# EAGLE design Nixie_v1 (EAGLE 8.7.0)
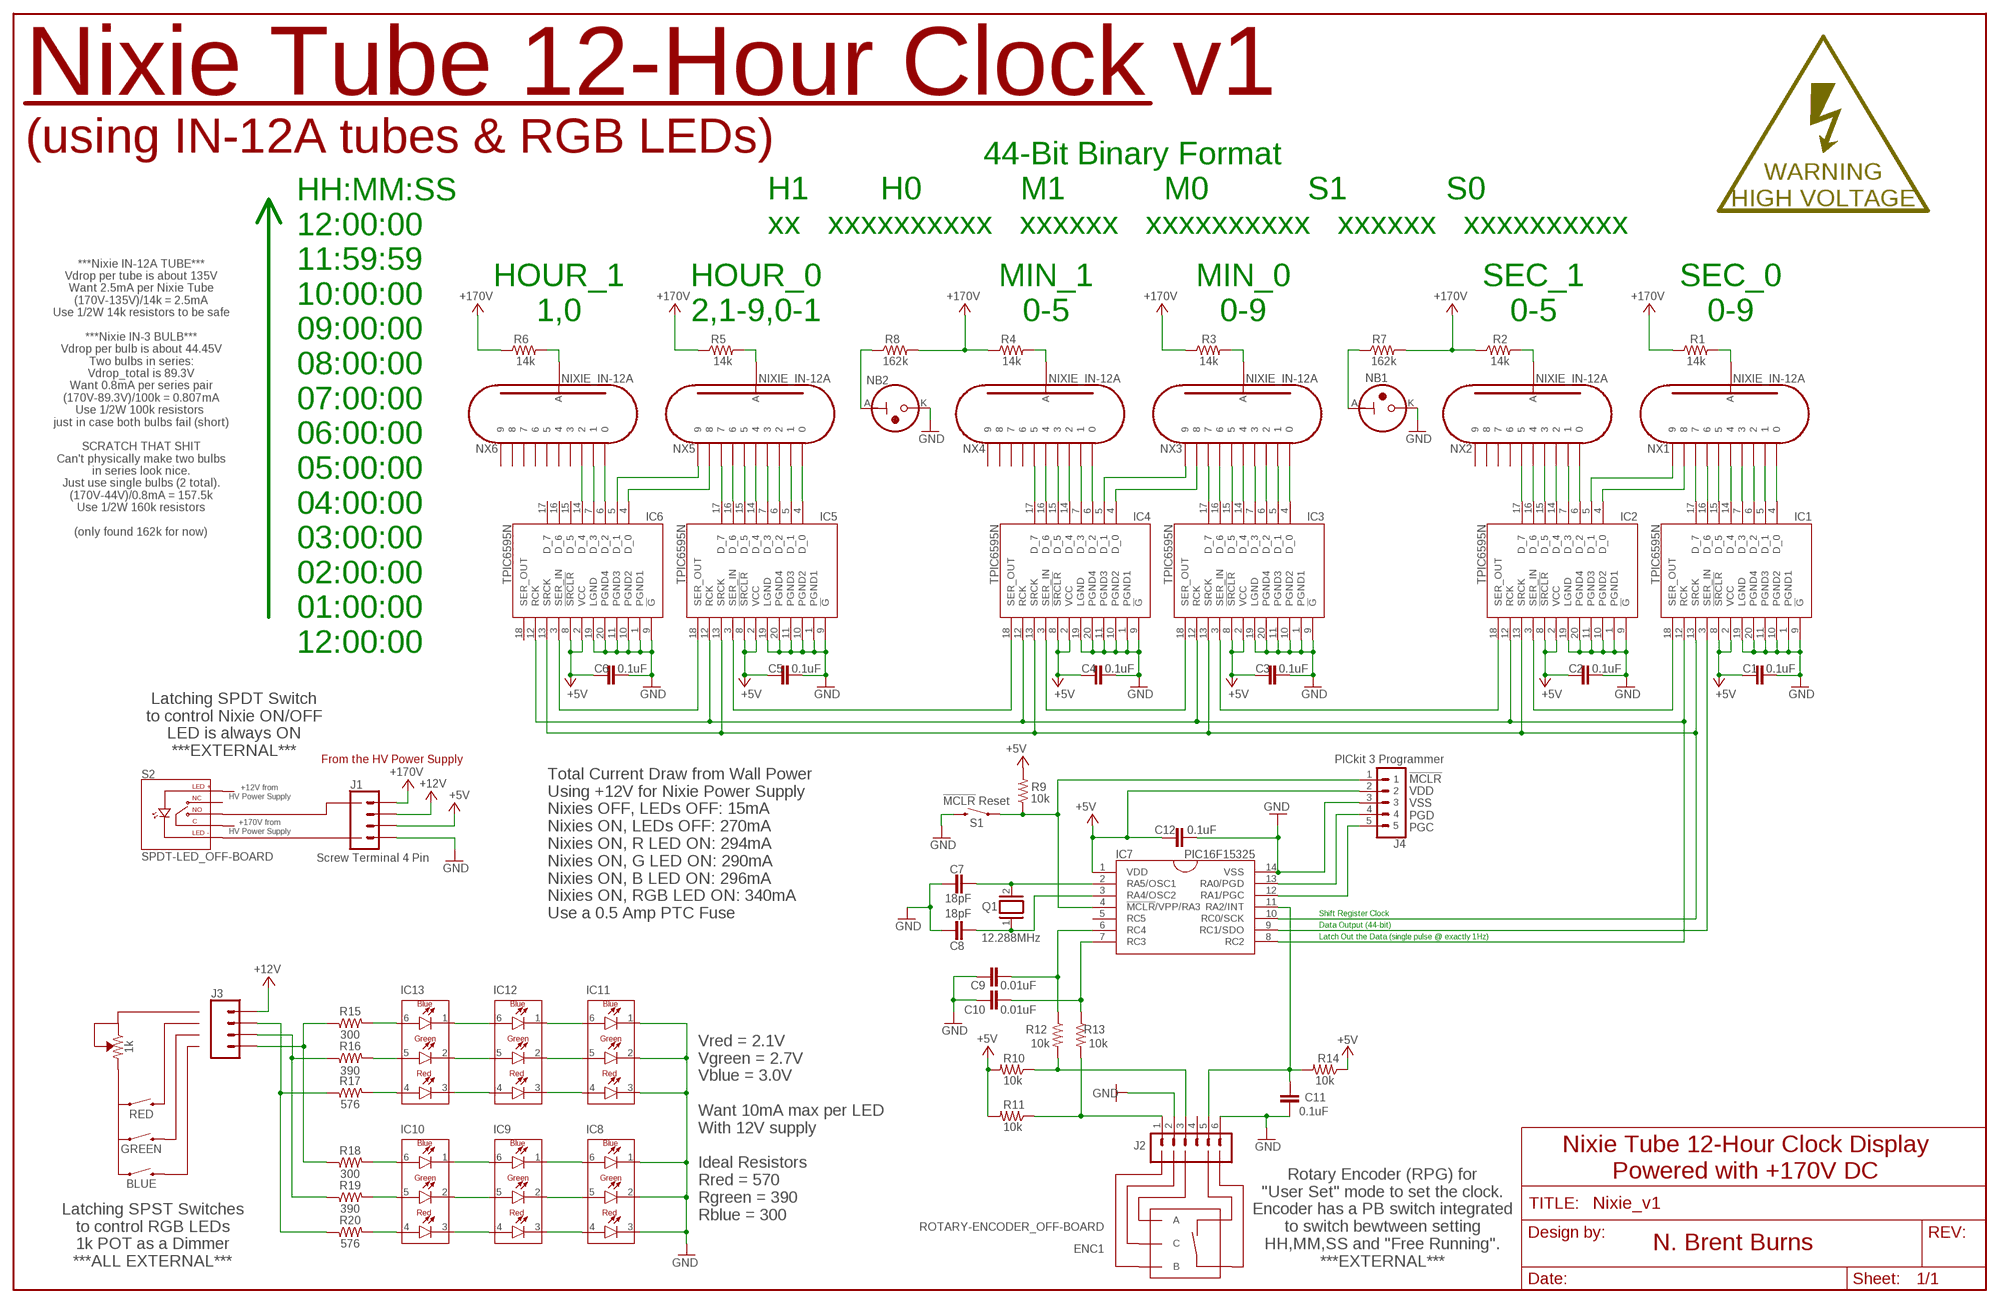
[diagram p0: schematic, sheet 1]

## Parts
C1  0.1uF  C2.5/2  [C2.5-2]
C2  0.1uF  C2.5/2  [C2.5-2]
C3  0.1uF  C2.5/2  [C2.5-2]
C4  0.1uF  C2.5/2  [C2.5-2]
C5  0.1uF  C2.5/2  [C2.5-2]
C6  0.1uF  C2.5/2  [C2.5-2]
C7  18pF  C2.5/2  [C2.5-2]
C8  18pF  C2.5/2  [C2.5-2]
C9  0.01uF  C2.5/2  [C2.5-2]
C10  0.01uF  C2.5/2  [C2.5-2]
C11  0.1uF  C2.5/2  [C2.5-2]
C12  0.1uF  C2.5/2  [C2.5-2]
ENC1  ROTARY-ENCODER_OFF-BOARD  (no package)
IC1  TPIC6595N  SHIFT_REG_TPIC6595N  [DIP20]
IC2  TPIC6595N  SHIFT_REG_TPIC6595N  [DIP20]
IC3  TPIC6595N  SHIFT_REG_TPIC6595N  [DIP20]
IC4  TPIC6595N  SHIFT_REG_TPIC6595N  [DIP20]
IC5  TPIC6595N  SHIFT_REG_TPIC6595N  [DIP20]
IC6  TPIC6595N  SHIFT_REG_TPIC6595N  [DIP20]
IC7  PIC16F15325  [DIP14]
IC8  LED-RGB_CLY6D-FKC-CK1N1D1BB7D3D3  [PLCC6-LED-RGB]
IC9  LED-RGB_CLY6D-FKC-CK1N1D1BB7D3D3  [PLCC6-LED-RGB]
IC10  LED-RGB_CLY6D-FKC-CK1N1D1BB7D3D3  [PLCC6-LED-RGB]
IC11  LED-RGB_CLY6D-FKC-CK1N1D1BB7D3D3  [PLCC6-LED-RGB]
IC12  LED-RGB_CLY6D-FKC-CK1N1D1BB7D3D3  [PLCC6-LED-RGB]
IC13  LED-RGB_CLY6D-FKC-CK1N1D1BB7D3D3  [PLCC6-LED-RGB]
J1  Screw Terminal 4 Pin  CONNECTOR_4PIN  [SCREW_TERM_5MM_1X4]
J2  CONNECTOR_6PINSCREW_TERMINAL_5MM_PITCH  [SCREW_TERM_5MM_1X6]
J3  RGB Switches and 5k POT Connections  CONNECTOR_4PIN  [SCREW_TERM_5MM_1X4]
J4  PICkit 3 Programmer  CONNECTOR_5PIN  [HEADER_2.54MM_1X5]
NB1  IN-3  [IN-3]
NB2  IN-3  [IN-3]
NX1  NIXIE_IN-12A  NIXIE_IN-12ANO_HOLE  [IN-12_NO_HOLE]
NX2  NIXIE_IN-12A  NIXIE_IN-12ANO_HOLE  [IN-12_NO_HOLE]
NX3  NIXIE_IN-12A  NIXIE_IN-12ANO_HOLE  [IN-12_NO_HOLE]
NX4  NIXIE_IN-12A  NIXIE_IN-12ANO_HOLE  [IN-12_NO_HOLE]
NX5  NIXIE_IN-12A  NIXIE_IN-12ANO_HOLE  [IN-12_NO_HOLE]
NX6  NIXIE_IN-12A  NIXIE_IN-12ANO_HOLE  [IN-12_NO_HOLE]
POT1  1k  POT_OFF-BOARD  (no package)
Q1  12.288MHz  XTAL/S  [QS]
R1  14k  R-US_0411/12  [0411/12]
R2  14k  R-US_0411/12  [0411/12]
R3  14k  R-US_0411/12  [0411/12]
R4  14k  R-US_0411/12  [0411/12]
R5  14k  R-US_0411/12  [0411/12]
R6  14k  R-US_0411/12  [0411/12]
R7  162k  R-US_0411/12  [0411/12]
R8  162k  R-US_0411/12  [0411/12]
R9  10k  R-US_0207/7  [0207/7]
R10  10k  R-US_0207/7  [0207/7]
R11  10k  R-US_0207/7  [0207/7]
R12  10k  R-US_0207/7  [0207/7]
R13  10k  R-US_0207/7  [0207/7]
R14  10k  R-US_0207/7  [0207/7]
R15  300  R-US_0207/7  [0207/7]
R16  390  R-US_0207/7  [0207/7]
R17  576  R-US_0207/7  [0207/7]
R18  300  R-US_0207/7  [0207/7]
R19  390  R-US_0207/7  [0207/7]
R20  576  R-US_0207/7  [0207/7]
S1  !MCLR! Reset  MOMENTARY-SWITCH-SPST-PTH-6.0MM  [TACTILE_SWITCH_PTH_6.0MM]
S2  SPDT-LED_OFF-BOARD  (no package)
S3  BLUE  SPST_OFF-BOARD  (no package)
S4  GREEN  SPST_OFF-BOARD  (no package)
S5  RED  SPST_OFF-BOARD  (no package)
SYM101  SYMBOL_HIGH_VOLTAGE  [SYMBOL_HIGH_VOLTAGE]

## Nets
+5V [POWER]: C1.2 C2.2 C3.2 C4.2 C5.2 C6.2 C12.1 IC1.2(VCC) IC1.8(!SRCLR) IC2.2(VCC) IC2.8(!SRCLR) IC3.2(VCC) IC3.8(!SRCLR) IC4.2(VCC) IC4.8(!SRCLR) IC5.2(VCC) IC5.8(!SRCLR) IC6.2(VCC) IC6.8(!SRCLR) IC7.1(VDD) J1.2 J4.2 R9.2 R10.2 R11.2 R14.1
+12V [POWER]: J1.3 J3.4
+170V [POWER]: J1.4 R1.1 R2.1 R3.1 R4.1 R5.1 R6.1 R7.2 R8.2
GND [GND]: C1.1 C2.1 C3.1 C4.1 C5.1 C6.1 C7.2 C8.2 C9.2 C10.2 C11.1 C12.2 IC1.1(PGND1) IC1.9(!G) IC1.10(PGND2) IC1.11(PGND3) IC1.19(LGND) IC1.20(PGND4) IC2.1(PGND1) IC2.9(!G) IC2.10(PGND2) IC2.11(PGND3) IC2.19(LGND) IC2.20(PGND4) IC3.1(PGND1) IC3.9(!G) IC3.10(PGND2) IC3.11(PGND3) IC3.19(LGND) IC3.20(PGND4) IC4.1(PGND1) IC4.9(!G) IC4.10(PGND2) IC4.11(PGND3) IC4.19(LGND) IC4.20(PGND4) IC5.1(PGND1) IC5.9(!G) IC5.10(PGND2) IC5.11(PGND3) IC5.19(LGND) IC5.20(PGND4) IC6.1(PGND1) IC6.9(!G) IC6.10(PGND2) IC6.11(PGND3) IC6.19(LGND) IC6.20(PGND4) IC7.14(VSS) IC8.1(BLUE_CATHODE) IC8.2(GREEN_CATHODE) IC8.3(RED_CATHODE) IC11.1(BLUE_CATHODE) IC11.2(GREEN_CATHODE) IC11.3(RED_CATHODE) J1.1 J2.2 J2.6 J4.3 NB1.K NB2.K S1.3
N$2: IC1.4(D_0) NX1.0
N$3: IC1.5(D_1) NX1.1
N$4: IC1.6(D_2) NX1.2
N$5: IC1.7(D_3) NX1.3
N$6: IC1.14(D_4) NX1.4
N$7: IC1.15(D_5) NX1.5
N$8: IC1.16(D_6) NX1.6
N$9: IC1.17(D_7) NX1.7
N$10: NX1.A R1.2
N$11: NB2.A R8.1
N$12: NX2.A R2.2
N$13: NB1.A R7.1
N$14: NX3.A R3.2
N$15: NX4.A R4.2
N$16: NX5.A R5.2
N$17: NX6.A R6.2
N$18: IC5.4(D_0) NX5.0
N$19: IC5.5(D_1) NX5.1
N$20: IC2.4(D_0) NX1.8
N$21: IC2.5(D_1) NX1.9
N$22: IC7.12(RA1/PGC) J4.5
N$23: IC2.6(D_2) NX2.0
N$24: IC2.7(D_3) NX2.1
N$25: IC2.15(D_5) NX2.3
N$26: IC2.16(D_6) NX2.4
N$27: IC2.17(D_7) NX2.5
N$28: IC3.4(D_0) NX3.0
N$29: IC3.5(D_1) NX3.1
N$30: IC3.6(D_2) NX3.2
N$31: IC3.7(D_3) NX3.3
N$32: IC3.14(D_4) NX3.4
N$33: IC3.15(D_5) NX3.5
N$34: IC3.16(D_6) NX3.6
N$35: IC3.17(D_7) NX3.7
N$36: IC4.4(D_0) NX3.8
N$37: IC4.5(D_1) NX3.9
N$38: C7.1 IC7.2(RA5/OSC1) Q1.2
N$39: C8.1 IC7.3(RA4/OSC2) Q1.1
N$40: IC7.13(RA0/PGD) J4.4
N$41: IC4.15(D_5) NX4.3
N$42: IC4.16(D_6) NX4.4
N$43: IC4.17(D_7) NX4.5
N$44: IC5.6(D_2) NX5.2
N$45: IC5.7(D_3) NX5.3
N$46: IC5.14(D_4) NX5.4
N$47: IC5.15(D_5) NX5.5
N$48: IC5.16(D_6) NX5.6
N$49: IC5.17(D_7) NX5.7
N$50: IC6.4(D_0) NX5.8
N$51: IC6.5(D_1) NX5.9
N$52: IC6.6(D_2) NX6.0
N$53: IC6.7(D_3) NX6.1
N$54: IC5.18(SER_OUT) IC6.3(SER_IN)
N$55: IC4.18(SER_OUT) IC5.3(SER_IN)
N$56: IC3.18(SER_OUT) IC4.3(SER_IN)
N$57: IC2.18(SER_OUT) IC3.3(SER_IN)
N$58: IC1.18(SER_OUT) IC2.3(SER_IN)
N$59: IC1.12(RCK) IC2.12(RCK) IC3.12(RCK) IC4.12(RCK) IC5.12(RCK) IC6.12(RCK) IC7.8(RC2)
N$60: IC2.14(D_4) NX2.2
N$61: IC1.13(SRCK) IC2.13(SRCK) IC3.13(SRCK) IC4.13(SRCK) IC5.13(SRCK) IC6.13(SRCK) IC7.10(RC0/SCK)
N$62: IC1.3(SER_IN) IC7.9(RC1/SDO)
N$63: IC4.14(D_4) NX4.2
N$64: IC4.7(D_3) NX4.1
N$65: IC4.6(D_2) NX4.0
N$66: IC7.4(!MCLR!/VPP/RA3) J4.1 R9.1 S1.1
N$67: IC6.14(D_4) NX6.2
N$68: C11.2 IC7.11(RA2/INT) J2.5 R14.2
N$70: C10.1 IC7.7(RC3) R13.1
N$72: IC12.6(BLUE_ANODE) IC13.1(BLUE_CATHODE)
N$73: IC11.6(BLUE_ANODE) IC12.1(BLUE_CATHODE)
N$74: IC8.6(BLUE_ANODE) IC9.1(BLUE_CATHODE)
N$75: IC9.6(BLUE_ANODE) IC10.1(BLUE_CATHODE)
N$76: IC12.5(GREEN_ANODE) IC13.2(GREEN_CATHODE)
N$77: IC11.5(GREEN_ANODE) IC12.2(GREEN_CATHODE)
N$78: IC11.4(RED_ANODE) IC12.3(RED_CATHODE)
N$79: IC12.4(RED_ANODE) IC13.3(RED_CATHODE)
N$80: IC9.5(GREEN_ANODE) IC10.2(GREEN_CATHODE)
N$81: IC8.5(GREEN_ANODE) IC9.2(GREEN_CATHODE)
N$82: IC8.4(RED_ANODE) IC9.3(RED_CATHODE)
N$83: IC9.4(RED_ANODE) IC10.3(RED_CATHODE)
N$84: J2.3 R10.1 R12.2
N$85: J2.1 R11.1 R13.2
N$86: C9.1 IC7.6(RC4) R12.1
N$88: J3.1 R15.1 R18.1
N$89: J3.2 R16.1 R19.1
N$90: J3.3 R17.1 R20.1
N$94: IC13.6(BLUE_ANODE) R15.2
N$95: IC13.5(GREEN_ANODE) R16.2
N$96: IC13.4(RED_ANODE) R17.2
N$97: IC10.6(BLUE_ANODE) R18.2
N$98: IC10.5(GREEN_ANODE) R19.2
N$99: IC10.4(RED_ANODE) R20.2
Unconnected: ENC1.A ENC1.B ENC1.C ENC1.SW+ ENC1.SW- IC6.15(D_5) IC6.16(D_6) IC6.17(D_7) IC6.18(SER_OUT) IC7.5(RC5) J2.4 NX2.6 NX2.7 NX2.8 NX2.9 NX4.6 NX4.7 NX4.8 NX4.9 NX6.3 NX6.4 NX6.5 NX6.6 NX6.7 NX6.8 NX6.9 POT1.CCW POT1.CW POT1.WIPER S2.C S2.LED+ S2.LED- S2.NC S2.NO S3.1 S3.2 S4.1 S4.2 S5.1 S5.2

## Notes on the sheet
- Nixie Tube 12-Hour Clock v1
- (using IN-12A tubes & RGB LEDs)
- 44-Bit Binary Format
  H1        H0           M1           M0           S1           S0
  xx   xxxxxxxxxx   xxxxxx   xxxxxxxxxx   xxxxxx   xxxxxxxxxx
- HOUR_1
  1,0
- HOUR_0
  2,1-9,0-1
- MIN_1
  0-5
- MIN_0
  0-9
- SEC_1
  0-5
- SEC_0
  0-9
- ***Nixie IN-12A TUBE***
  Vdrop per tube is about 135V
  Want 2.5mA per Nixie Tube
  (170V-135V)/14k = 2.5mA
  Use 1/2W 14k resistors to be safe
  
  ***Nixie IN-3 BULB***
  Vdrop per bulb is about 44.45V
  Two bulbs in series:
  Vdrop_total is 89.3V
  Want 0.8mA per series pair
  (170V-89.3V)/100k = 0.807mA
  Use 1/2W 100k resistors 
  just in case both bulbs fail (short)
  
  SCRATCH THAT SHIT
  Can't physically make two bulbs
  in series look nice.
  Just use single bulbs (2 total).
  (170V-44V)/0.8mA = 157.5k
  Use 1/2W 160k resistors
  
  (only found 162k for now)
- HH:MM:SS
  12:00:00
  11:59:59
  10:00:00
  09:00:00
  08:00:00
  07:00:00
  06:00:00
  05:00:00
  04:00:00
  03:00:00
  02:00:00
  01:00:00
  12:00:00
- Latching SPDT Switch
  to control Nixie ON/OFF
  LED is always ON
  ***EXTERNAL***
- From the HV Power Supply
- +12V from
  HV Power Supply
- !MCLR
  VDD
  VSS
  PGD
  PGC
- +170V from
  HV Power Supply
- Shift Register Clock
- Total Current Draw from Wall Power
  Using +12V for Nixie Power Supply
  Nixies OFF, LEDs OFF: 15mA
  Nixies ON, LEDs OFF: 270mA
  Nixies ON, R LED ON: 294mA
  Nixies ON, G LED ON: 290mA
  Nixies ON, B LED ON: 296mA
  Nixies ON, RGB LED ON: 340mA
  Use a 0.5 Amp PTC Fuse
- Data Output (44-bit)
- Latch Out the Data (single pulse @ exactly 1Hz)
- Nixie Tube 12-Hour Clock Display
  Powered with +170V DC
- Vred = 2.1V
  Vgreen = 2.7V
  Vblue = 3.0V
  
  Want 10mA max per LED
  With 12V supply
  
  Ideal Resistors
  Rred = 570
  Rgreen = 390
  Rblue = 300
- N. Brent Burns
- Latching SPST Switches
  to control RGB LEDs
  1k POT as a Dimmer
  ***ALL EXTERNAL***
- Rotary Encoder (RPG) for
  "User Set" mode to set the clock.
  Encoder has a PB switch integrated
  to switch bewtween setting
  HH,MM,SS and "Free Running".
  ***EXTERNAL***

## Library data of the parts
C1-C12 = capacitor-wima:C: CAPACITOR naming: grid - package width
ENC1 = Brent2:ROTARY-ENCODER_OFF-BOARD
IC1-IC6 = Brent:SHIFT_REG_TPIC6595N
IC7 = Brent:PIC16F15325
IC8-IC13 = Brent:LED-RGB_CLY6D-FKC-CK1N1D1BB7D3D3
J1 J3 = Brent:CONNECTOR_4PIN
J2 = Brent:CONNECTOR_6PIN
J4 = Brent:CONNECTOR_5PIN
NB1 NB2 = russian-nixies:IN-3: IN-3: nixie bulb
NX1-NX6 = Brent:NIXIE_IN-12A
POT1 = Brent2:POT_OFF-BOARD
Q1 = special:XTAL/S: CRYSTAL
R1-R20 = rcl:R-US_: RESISTOR, American symbol; SPICEPREFIX: R
S1 = SparkFun-Switches:MOMENTARY-SWITCH-SPST: Momentary Switch (Pushbutton) - SPST Normally-open (NO) SPST momentary switches (buttons, pushbuttons). Variants PTH-12MM - 12mm square, through-hole Momentary Pushbutton Switch - 12mm Square <https://www.sparkfun.com/products/9190> (COM-09190) PTH-6.0MM, PTH-6.0MM-KIT - 6.0mm square, through-hole Mini Pushbutton Switch <https://www.sparkfun.com/products/97> (COM-00097) KIT package intended for soldering kit's - only one side of pads' copper is exposed. PTH-RIGHT-ANGLE-KIT - Right-angle, through-hole Right Angle Tactile Button <https://www.sparkfun.com/products/10791> - Used on SparkFun BigTime Watch Kit <https://www.sparkfun.com/products/11734> SMD-12MM - 12mm square, surface-mount Tactile Button - SMD (12mm) <https://www.sparkfun.com/products/12993> (COM-12993) Used on SparkFun PicoBoard <https://www.sparkfun.com/products/11888> SMD-4.5MM - 4.5mm Square Trackball Switch Used on SparkFun Blackberry Trackballer Breakout <https://www.sparkfun.com/products/13169> SMD-4.6MMX2.8MM - 4.60mm x 2.80mm, surface mount Used on SparkFun SAMD21 Mini Breakout <https://www.sparkfun.com/products/13664> SMD-5.2MM, SMD-5.2-REDUNDANT - 5.2mm square, surface-mount Mini Pushbutton Switch - SMD <https://www.sparkfun.com/products/8720> (COM-08720) Used on Arduino Pro Mini <https://www.sparkfun.com/products/11114> REDUNDANT package connects both switch circuits together SMD-6.0X3.5MM - 6.0 x 3.5mm, surface mount Momentary Reset Switch SMD <https://www.sparkfun.com/products/8229> (COM-08229) SMD-6.2MM-TALL - 6.2mm square, surface mount Tactile Button - SMD (6mm) <https://www.sparkfun.com/products/12992> Used on SparkFun Digital Sandbox <https://www.sparkfun.com/products/12651> SMD-RIGHT-ANGLE - Right-angle, surface mount Used on SparkFun Block for Intel® Edison - Arduino <https://www.sparkfun.com/products/13036>; PROD_ID: SWCH-08441; SF_SKU: COM-00097
S2 = Brent2:SPDT-LED_OFF-BOARD
S3-S5 = Brent2:SPST_OFF-BOARD
SYM101 = Brent:SYMBOL_HIGH_VOLTAGE

## Net classes
0 default: width 0.254 mm, clearance 0.205 mm
1 GND: width 0.762 mm, clearance 0.205 mm to class 0, clearance 0.205 mm
2 POWER: width 0.762 mm, clearance 0.205 mm to class 0, clearance 0.205 mm to class 1, clearance 0.205 mm

## Board
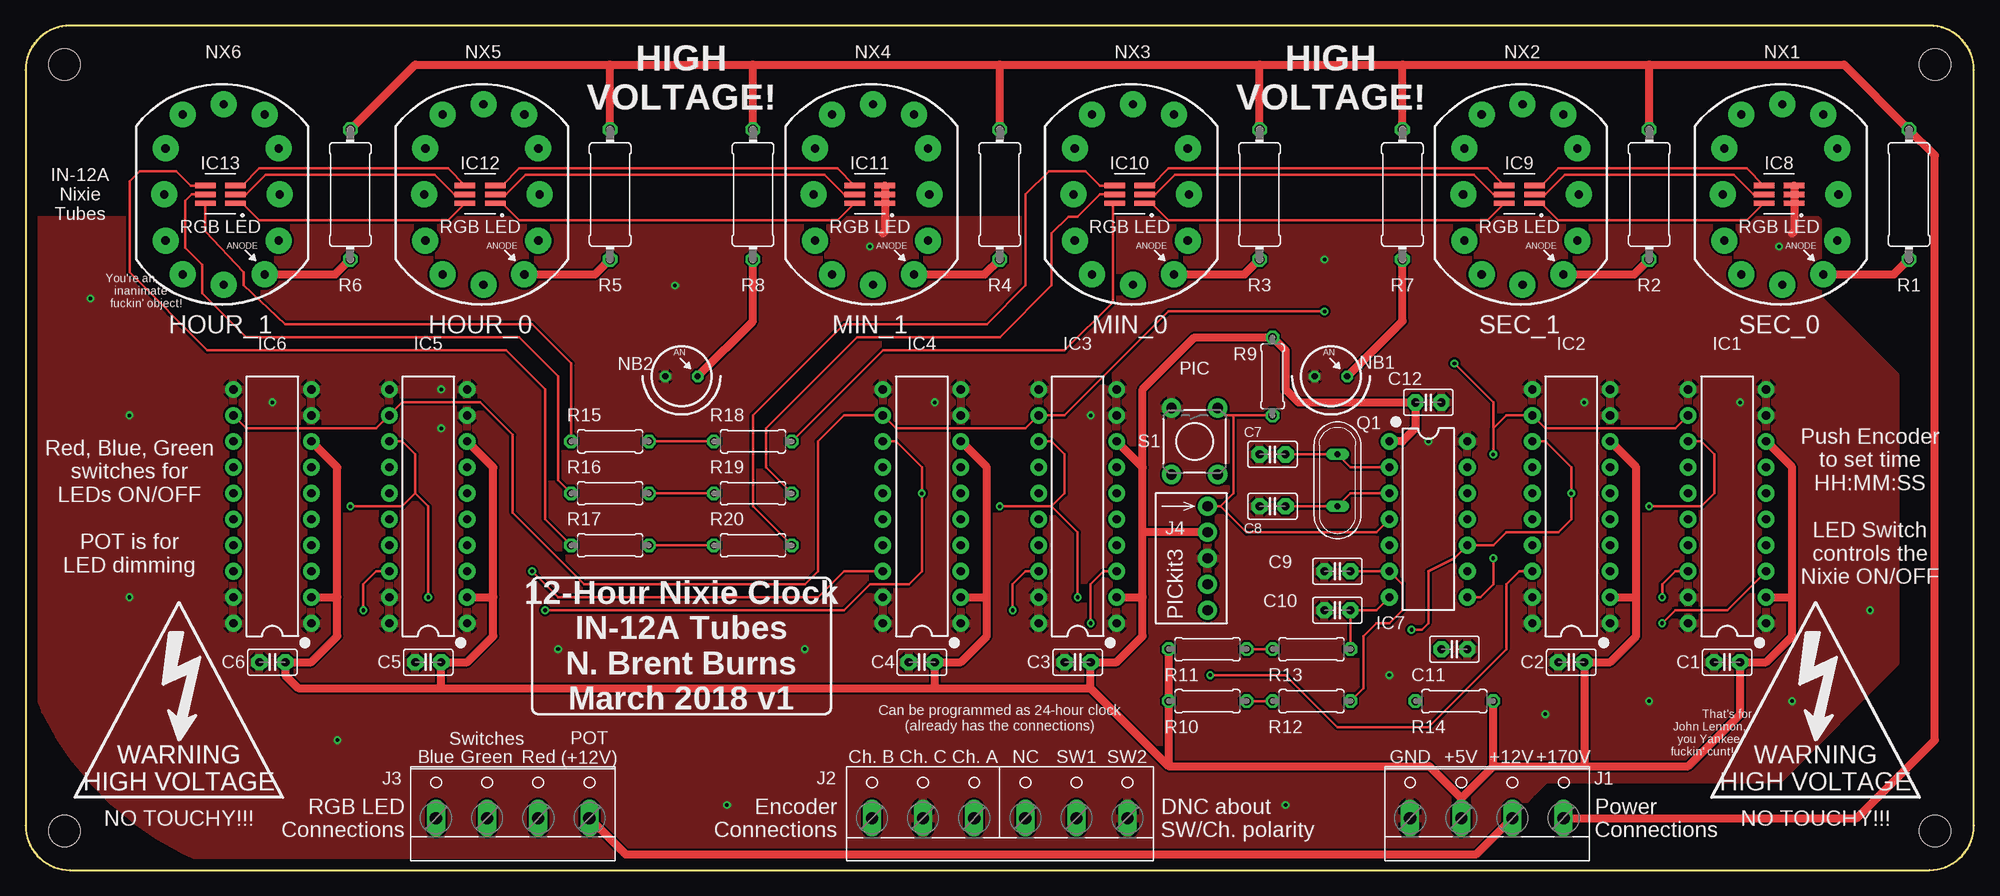
[diagram p1: board, top side]
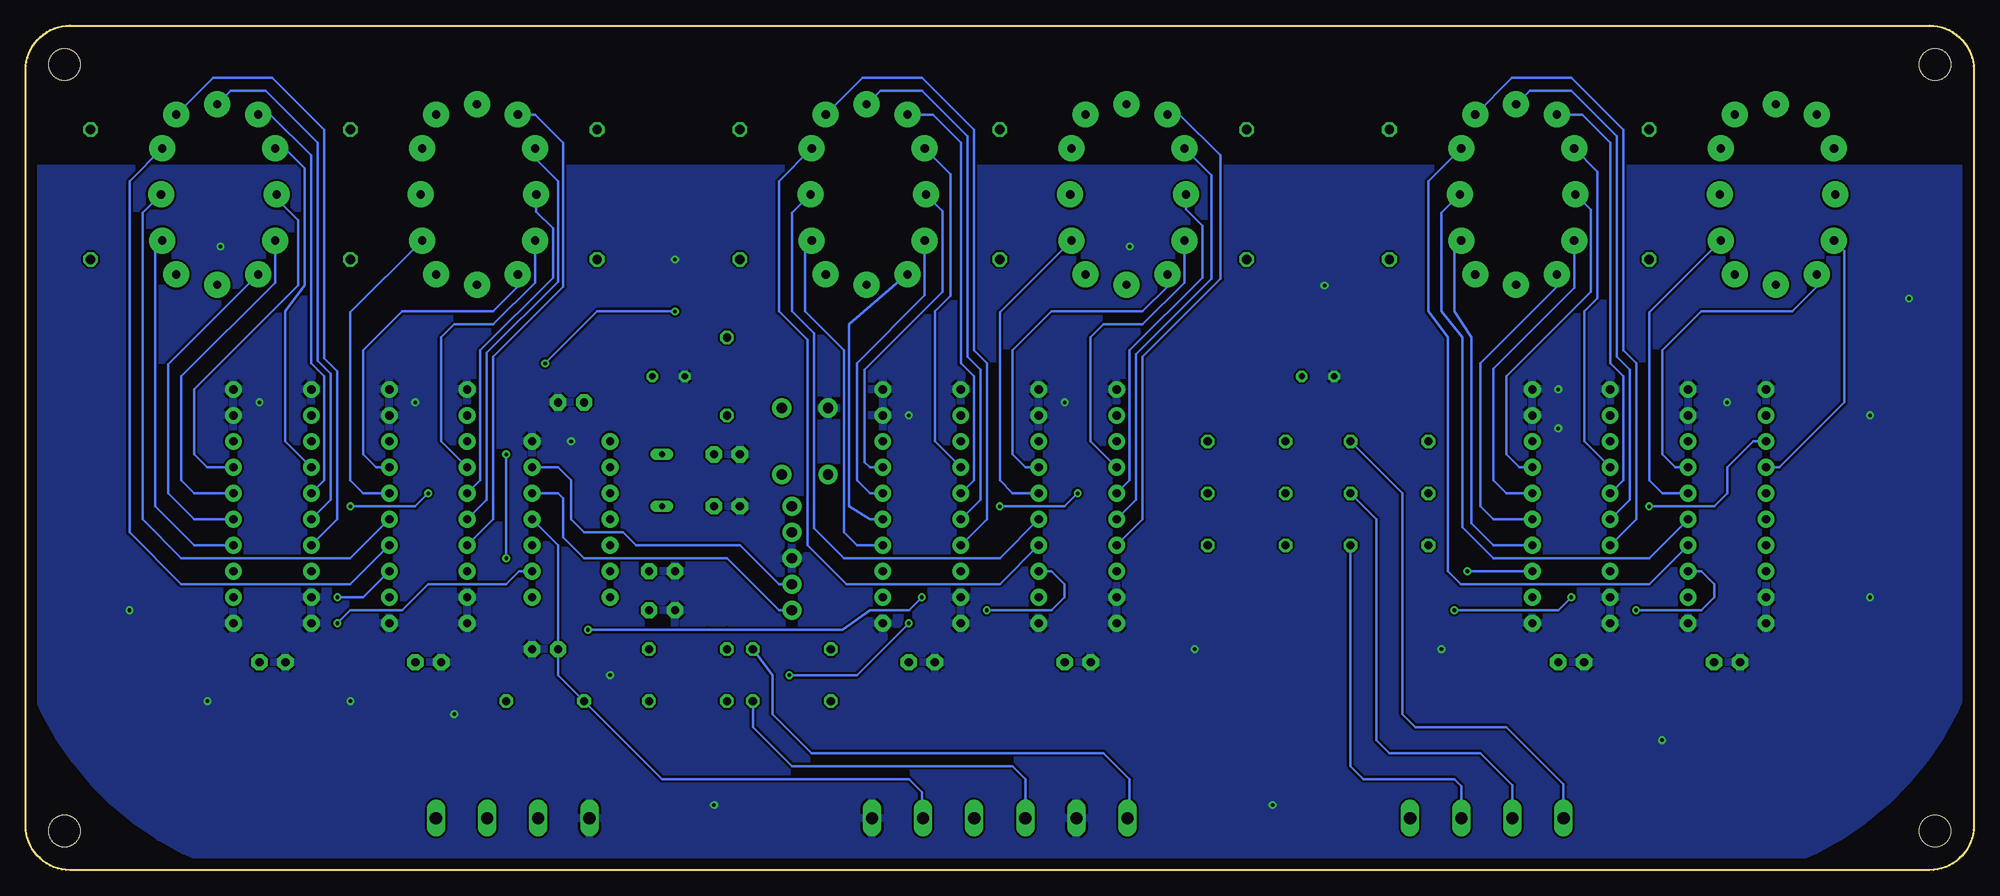
[diagram p2: board, bottom side, seen from below]

Size 190.5 x 82.55 mm. Coordinates in mm from the lower left corner, seen from the top.
Outline: 0,78.21 0,4.34 arc90 4.34,0 186.16,0 arc90 190.5,4.34 190.5,78.21 arc90 186.16,82.55 4.34,82.55 arc90 0,78.21
Copper layers (1*16): Top 0.035mm / dielectric 1.5mm / Bottom 0.035mm
Design rules "default *": minimum track width 10mil, minimum drill 0.35mm, track to track 6mil, track to pad 6mil, pad to pad 6mil, via to via 6mil, smd to smd 6mil, copper to edge 40mil, drill to drill 6mil, minimum pad ring 10mil, minimum via ring 8mil, stop-mask expansion 4mil, vias tented up to drill 0mil, thermal gap 10mil
Holes 3.1 mm at 3.81,3.81 186.69,3.81 186.69,78.74 3.81,78.74

### Footprints (pad centres in the part's own frame; a part is rotated, then mirrored left to right if it is on the bottom)
C2.5-2 = drill 0.813 pad 1.6 octagon: 1 -1.27,0; 2 1.27,0
DIP20 = drill 0.813 pad 1.626: 1 -10.16,-3.81; 2 -7.62,-3.81; 3 -5.08,-3.81; 4 -2.54,-3.81; 5 0,-3.81; 6 2.54,-3.81; 7 5.08,-3.81; 8 7.62,-3.81; 9 10.16,-3.81; 10 12.7,-3.81; 11 12.7,3.81; 12 10.16,3.81; 13 7.62,3.81; 14 5.08,3.81; 15 2.54,3.81; 16 0,3.81; 17 -2.54,3.81; 18 -5.08,3.81; 19 -7.62,3.81; 20 -10.16,3.81
DIP14 = drill 0.813 pad 1.626: 1 -7.62,-3.81; 2 -5.08,-3.81; 3 -2.54,-3.81; 4 0,-3.81; 5 2.54,-3.81; 6 5.08,-3.81; 7 7.62,-3.81; 8 7.62,3.81; 9 5.08,3.81; 10 2.54,3.81; 11 0,3.81; 12 -2.54,3.81; 13 -5.08,3.81; 14 -7.62,3.81
PLCC6-LED-RGB = smd 2 x 0.5: 1 -1.475,0.873; 2 -1.475,0; 3 -1.475,-0.873; 4 1.475,-0.873; 5 1.475,0; 6 1.475,0.873
SCREW_TERM_5MM_1X4 = drill 1.194 long: 1 -7.5,-1.27; 2 -2.5,-1.27; 3 2.5,-1.27; 4 7.5,-1.27
SCREW_TERM_5MM_1X6 = drill 1.194 long: 1 -12.5,-1.27; 2 -7.5,-1.27; 3 -2.5,-1.27; 4 2.5,-1.27; 5 7.5,-1.27; 6 12.5,-1.27
HEADER_2.54MM_1X5 = drill 1.016 pad 1.88: 1 0,0; 2 2.54,0; 3 5.08,0; 4 7.62,0; 5 10.16,0
IN-3 = drill 0.6 octagon: A -1.587,0; K 1.587,0
IN-12_NO_HOLE = drill 0.8 pad 2.54: 0 5.048,-4.5; 1 -4.317,-7.817; 2 -6,-4.5; 3 -6.127,0; 4 -6,4.5; 5 -4.317,7.817; 6 -0.318,8.818; 7 3.683,7.817; 8 5.048,4.5; 9 5.175,0; A 3.683,-7.817; LHDP -0.318,-8.818
QS = drill 0.61 long: 1 -2.54,0; 2 2.54,0
0411/12 = drill 0.914 octagon: 1 -6.35,0; 2 6.35,0
0207/7 = drill 0.813 octagon: 1 -3.81,0; 2 3.81,0
TACTILE_SWITCH_PTH_6.0MM = drill 1.016 pad 1.88: 1 -3.251,2.261; 2 3.251,2.261; 3 -3.251,-2.261; 4 3.251,-2.261

### Placement (x,y rotation side)
C1  166.37,20.32 0 top
C2  151.13,20.32 0 top
C3  102.87,20.32 0 top
C4  87.63,20.32 0 top
C5  39.37,20.32 0 top
C6  24.13,20.32 0 top
C7  121.92,40.64 180 top
C8  121.92,35.56 180 top
C9  128.27,29.21 180 top
C10  128.27,25.4 180 top
C11  139.7,21.59 180 top
C12  137.16,45.72 0 top
IC1  166.37,34.29 90 top
IC2  151.13,34.29 90 top
IC3  102.87,34.29 90 top
IC4  87.63,34.29 90 top
IC5  39.37,34.29 90 top
IC6  24.13,34.29 90 top
IC7  137.16,34.29 270 top
IC8  171.45,66.04 180 top
IC9  146.05,66.04 180 top
IC10  107.95,66.04 180 top
IC11  82.55,66.04 180 top
IC12  44.45,66.04 180 top
IC13  19.05,66.04 180 top
J1  142.88,6.35 0 top
J2  95.25,6.35 0 top
J3  47.62,6.35 0 top
J4  115.57,35.56 270 top
NB1  127.64,48.26 180 top
NB2  64.14,48.26 180 top
NX1  172.09,66.04 0 top
NX2  146.69,66.04 0 top
NX3  108.58,66.04 0 top
NX4  83.19,66.04 0 top
NX5  45.09,66.04 0 top
NX6  19.68,66.04 0 top
Q1  128.27,38.1 90 top
R1  184.15,66.04 270 top
R2  158.75,66.04 270 top
R3  120.65,66.04 270 top
R4  95.25,66.04 270 top
R5  57.15,66.04 270 top
R6  31.75,66.04 270 top
R7  134.62,66.04 90 top
R8  71.12,66.04 90 top
R9  121.92,48.26 90 top
R10  115.57,16.51 180 top
R11  115.57,21.59 180 top
R12  125.73,16.51 180 top
R13  125.73,21.59 180 top
R14  139.7,16.51 180 top
R15  57.15,41.91 180 top
R16  57.15,36.83 180 top
R17  57.15,31.75 180 top
R18  71.12,41.91 0 top
R19  71.12,36.83 0 top
R20  71.12,31.75 0 top
S1  114.3,41.91 270 top
SYM101  175.02,7.11 0 top
U$3  SYMBOL_HIGH_VOLTAGE  [SYMBOL_HIGH_VOLTAGE]  15,7.11 0 top
U$6  SYMBOL_HIGH_VOLTAGE  [SYMBOL_HIGH_VOLTAGE]  15,7.11 0 top

### Tracks (layer width: path | path; a pad name or v marks a point on that pad's centre or on a via)
+5V
  Top 0.762: J1.2 140.38,7.03 | 140.38,7.03 143.51,10.16 | 143.51,10.16 152.4,10.16 | 152.4,10.16 162.56,10.16 167.64,15.24 C1.2 170.18,20.32 172.72,22.86 172.72,26.67 | 172.72,26.67 172.72,39.37 IC1.8 | IC1.2 172.72,26.67 | 157.48,26.67 157.48,22.86 154.94,20.32 C2.2 152.4,10.16 | 157.48,26.67 157.48,39.37 IC2.8 | IC2.2 157.48,26.67 | 109.22,26.67 109.22,22.86 106.68,20.32 C3.2 104.14,17.78 | 109.22,26.67 109.22,33.02 | 109.22,33.02 109.22,39.37 | 109.22,39.37 IC3.8 | IC3.2 109.22,26.67 | 93.98,26.67 93.98,22.86 91.44,20.32 C4.2 88.9,17.78 | 93.98,26.67 93.98,39.37 IC4.8 | IC4.2 93.98,26.67 | 45.72,26.67 45.72,22.86 43.18,20.32 C5.2 40.64,17.78 | 45.72,26.67 45.72,39.37 IC5.8 | IC5.2 45.72,26.67 | 30.48,26.67 30.48,22.86 27.94,20.32 C6.2 25.4,19.05 26.67,17.78 40.64,17.78 | 30.48,26.67 30.48,39.37 IC6.8 | IC6.2 30.48,26.67 | 40.64,17.78 88.9,17.78 | 88.9,17.78 104.14,17.78 | 104.14,17.78 111.76,10.16 | 140.38,7.03 137.24,10.16 111.76,10.16 | R11.2 R10.2 111.76,10.16 | 109.22,39.37 109.22,46.99 114.3,52.07 R9.2 123.19,50.8 123.19,46.99 124.46,45.72 C12.1 135.89,43.18 134.62,41.91 IC7.1 | 143.51,10.16 R14.1 | J4.2 109.22,33.02
+12V
  Top 0.762: J1.3 141.79,1.5 58.71,1.5 J3.4
+170V
  Top 0.762: R6.1 38.1,78.74 57.15,78.74 | 57.15,78.74 71.12,78.74 | 71.12,78.74 95.25,78.74 | 95.25,78.74 120.65,78.74 | 120.65,78.74 134.62,78.74 | 134.62,78.74 158.75,78.74 | 158.75,78.74 177.8,78.74 R1.1 186.69,69.85 186.69,12.7 179.07,5.08 J1.4 | R2.1 158.75,78.74 | R7.2 134.62,78.74 | R3.1 120.65,78.74 | R4.1 95.25,78.74 | R8.2 71.12,78.74 | R5.1 57.15,78.74
GND  (via drill 0.35)
  Top 0.762: IC11.3 IC11.2 IC11.1 84.03,62.44 83.82,62.23 | IC8.3 IC8.2 IC8.1 172.93,62.44 172.72,62.23
  other vias: 6.35,55.88 10.16,44.45 10.16,26.67 30.48,12.7 68.58,6.35 123.19,6.35 133.35,19.05 148.59,15.24 158.75,16.51 172.72,16.51 180.34,25.4 171.45,60.96 82.55,60.96 167.64,45.72 152.4,45.72 137.16,41.91 104.14,44.45 88.9,45.72 24.13,45.72 40.64,43.18 40.64,46.99 63.5,57.15 127,59.69 76.2,21.59 52.07,21.59
  pour Bottom: -1.27,68.58 -1.27,29.08 arc90 29.08,-1.27 161.55,-1.27 arc90 191.77,28.95 191.77,68.58
  pour Top: 175.26,63.5 -1.27,63.5 -1.27,29.08 arc90 29.08,-1.27 139.7,-1.27 147.32,7.62 148.59,8.89 171.45,8.89 182.88,20.32 182.88,48.26 175.26,55.88
N$2
  Bottom 0.254: IC1.4 173.99,31.75 177.8,35.56 177.8,60.87 NX1.0
N$3
  Bottom 0.254: IC1.5 173.99,34.29 176.53,36.83 176.53,49.46 NX1.1
N$4
  Bottom 0.254: IC1.6 173.99,36.83 175.26,38.1 175.26,48.26 166.09,57.44 NX1.2
N$5
  Bottom 0.254: IC1.7 172.72,39.37 173.99,40.64 173.99,46.99 163.83,57.15 163.83,63.5 165.96,65.63 NX1.3
N$6
  Bottom 0.254: IC1.14 165.1,41.91 165.1,54.61 163.19,57.15 163.19,68.58 165.16,70.54 NX1.4
N$7
  Bottom 0.254: IC1.15 161.29,38.1 161.29,48.26 162.56,49.53 162.56,69.85 166.57,73.86 NX1.5
N$8
  Bottom 0.254: NX1.6 170.43,76.2 167,76.2 161.93,71.12 161.93,49.78 160.66,48.51 160.66,36.2 IC1.16
N$9
  Bottom 0.254: IC1.17 160.02,34.29 160.02,48.77 161.29,50.04 161.29,72.39 166.37,77.47 172.16,77.47 NX1.7
N$10
  Top 0.762: NX1.A 182.68,58.22 R1.2
N$11
  Top 0.762: NB2.A 71.12,53.66 R8.1
N$12
  Top 0.762: NX2.A 157.28,58.22 R2.2
N$13
  Top 0.762: NB1.A 134.62,53.66 R7.1
N$14
  Top 0.762: NX3.A 119.18,58.22 R3.2
N$15
  Top 0.762: NX4.A 93.78,58.22 R4.2
N$16
  Top 0.762: NX5.A 55.68,58.22 R5.2
N$17
  Top 0.762: NX6.A 30.28,58.22 R6.2
N$18
  Bottom 0.254: IC5.4 46.99,31.75 49.15,33.91 49.15,52.07 50.8,54.61 50.8,60.87 NX5.0
N$19
  Bottom 0.254: IC5.5 46.99,34.29 48.26,35.56 48.26,49.53 40.77,57.02 NX5.1
N$20
  Bottom 0.254: IC2.4 158.75,27.94 175.26,27.94 180.34,33.02 180.34,67.33 NX1.8
N$21
  Bottom 0.254: NX1.9 179.07,64.23 179.07,34.29 175.26,30.48 158.75,30.48 IC2.5
N$22
  Bottom 0.254: J4.5 116.84,25.4 121.92,30.48 135.89,30.48 137.92,32.51 137.92,36.32 138.43,36.83 IC7.12
N$23
  Bottom 0.254: IC2.6 157.48,36.83 158.75,38.1 158.75,54.52 NX2.0
N$24
  Bottom 0.254: IC2.7 156.21,39.37 157.48,40.64 157.48,50.8 153.67,54.61 144.78,54.61 142.37,57.02 NX2.1
N$25
  Bottom 0.254: IC2.15 146.05,38.1 146.05,50.8 138.94,57.91 138.94,62.74 140.56,64.36 NX2.3
N$26
  Bottom 0.254: IC2.16 145.41,36.2 145.41,50.55 138.43,57.53 138.43,67.31 140.69,69.56 NX2.4
N$27
  Bottom 0.254: IC2.17 144.78,34.29 144.78,50.16 137.92,57.02 137.92,71.12 140.66,73.86 NX2.5
N$28
  Bottom 0.254: IC3.4 109.22,31.75 110.49,33.02 110.49,50.8 114.3,54.61 114.3,60.87 NX3.0
N$29
  Bottom 0.254: IC3.5 107.95,34.29 109.98,35.56 109.98,53.34 104.34,58.22 NX3.1
N$30
  Bottom 0.254: IC3.6 107.95,36.83 109.22,38.1 109.22,49.53 102.58,56.16 102.58,56.26 NX3.2
N$31
  Bottom 0.254: IC3.7 107.95,39.37 108.46,39.88 108.46,48.9 100.84,56.52 100.84,64.42 NX3.3
N$32
  Bottom 0.254: IC3.14 101.6,41.91 101.6,54.61 100.08,56.13 100.08,68.03 NX3.4
N$33
  Bottom 0.254: IC3.15 97.79,38.1 97.79,48.26 99.06,49.53 99.06,71.12 101.8,73.86 NX3.5
N$34
  Bottom 0.254: IC3.16 97.16,36.2 97.16,48.9 98.42,50.16 98.42,71.75 102.87,76.2 106.92,76.2 NX3.6
N$35
  Bottom 0.254: IC3.17 96.52,34.29 96.52,49.53 97.79,50.8 97.79,72.39 102.87,77.47 108.66,77.47 NX3.7
N$36
  Bottom 0.254: IC4.4 95.25,27.94 110.24,27.94 114.05,31.75 114.05,51.82 116.84,54.61 116.84,67.33 NX3.8
N$37
  Bottom 0.254: IC4.5 95.25,30.48 110.49,30.48 113.41,33.4 113.41,52.45 115.57,54.61 115.57,64.23 NX3.9
N$38
  Top 0.254: C7.1 Q1.2 129.54,39.37 IC7.2
N$39
  Top 0.254: C8.1 Q1.1 129.54,36.83 IC7.3
N$40
  Bottom 0.254: J4.4 116.84,27.94 120.65,31.75 130.81,31.75 132.08,33.02 135.89,33.02 137.16,34.29 137.16,38.1 138.43,39.37 IC7.13
N$41
  Bottom 0.254: IC4.15 82.55,38.1 82.55,50.8 75.44,57.91 75.44,62.99 77.06,64.61 NX4.3
N$42
  Bottom 0.254: IC4.16 81.92,36.2 81.92,50.42 74.55,57.78 74.55,67.9 NX4.4
N$43
  Bottom 0.254: IC4.17 81.28,34.29 81.28,50.16 73.66,57.78 73.66,69.85 77.67,73.86 NX4.5
N$44
  Bottom 0.254: IC5.6 45.72,36.83 46.99,38.1 46.99,49.02 39.09,56.93 NX5.2
N$45
  Bottom 0.254: IC5.7 44.45,39.37 45.72,40.64 45.72,48.26 37.47,56.52 37.47,64.55 NX5.3
N$46
  Bottom 0.254: IC5.14 38.1,41.91 38.1,54.61 36.83,55.88 36.83,68.28 NX5.4
N$47
  Bottom 0.254: IC5.15 34.29,38.1 34.29,48.26 35.56,49.53 35.56,71.12 38.3,73.86 NX5.5
N$48
  Bottom 0.254: IC5.16 33.66,36.2 33.66,48.9 34.92,50.16 34.92,71.75 39.37,76.2 43.42,76.2 NX5.6
N$49
  Bottom 0.254: IC5.17 33.02,34.29 33.02,35.56 33.02,49.53 34.29,50.8 34.29,72.39 39.37,77.47 45.16,77.47 NX5.7
N$50
  Bottom 0.254: IC6.4 31.75,27.94 50.16,27.94 51.44,29.21 51.44,52.07 53.34,54.61 53.34,67.33 NX5.8
N$51
  Bottom 0.254: IC6.5 31.75,30.48 46.99,30.48 50.04,33.53 50.04,52.07 52.07,54.61 52.07,64.23 NX5.9
N$52
  Bottom 0.254: IC6.6 30.48,36.83 31.75,38.1 31.75,54.52 NX6.0
N$53
  Bottom 0.254: IC6.7 29.21,39.37 30.48,40.64 30.48,50.8 26.67,54.61 17.78,54.61 15.37,57.02 NX6.1
N$54  (via drill 0.35)
  Top 0.254: v33.02,25.4 33.02,27.94 34.29,29.21 IC5.18
  Bottom 0.254: IC6.3 26.67,29.21 25.4,27.94 25.4,26.67 26.67,25.4 v33.02,25.4
N$55  (via drill 0.35)
  Top 0.254: IC4.18 80.01,29.21 77.47,26.67 52.07,26.67 v49.53,29.21
  Bottom 0.254: v49.53,29.21 IC5.3
N$56  (via drill 0.35)
  Top 0.254: v96.52,25.4 96.52,27.94 97.79,29.21 IC3.18
  Bottom 0.254: IC4.3 90.17,29.21 88.9,27.94 88.9,26.67 90.17,25.4 v96.52,25.4
N$57  (via drill 0.35)
  Top 0.254: IC2.18 146.05,29.21 144.78,27.94 144.78,21.59 137.16,13.97 128.27,13.97 123.19,19.05 v115.82,19.05 | v104.14,24.13 104.14,27.94 105.41,29.21 IC3.3
  Bottom 0.254: v115.82,19.05 109.22,19.05 v104.14,24.13
N$58  (via drill 0.35)
  Top 0.254: v160.02,26.67 160.02,27.94 161.29,29.21 IC1.18
  Bottom 0.254: IC2.3 157.48,26.67 v160.02,26.67
N$59  (via drill 0.35)
  Top 0.254: IC1.12 161.29,43.18 148.59,43.18 IC2.12 144.78,44.45 143.51,43.18 | IC6.12 21.59,43.18 34.29,43.18 IC5.12 36.83,45.72 44.45,45.72 47.62,42.55 47.62,34.92 54.61,27.94 76.2,27.94 77.47,29.21 77.47,41.91 80.01,44.45 IC4.12 85.09,43.18 97.79,43.18 IC3.12 101.6,44.45 111.76,54.61 v127,54.61 | IC7.8 142.24,26.67 143.51,27.94 v143.51,30.48 | v143.51,40.64 143.51,43.18 | v139.7,49.53 143.51,45.72 143.51,43.18
  Bottom 0.254: v143.51,30.48 v143.51,40.64 | v127,54.61 134.62,54.61 v139.7,49.53
N$60
  Bottom 0.254: IC2.14 149.86,41.91 149.86,52.07 148.59,53.34 144.78,53.34 140.69,57.44 NX2.2
N$61  (via drill 0.35)
  Top 0.254: v31.75,35.56 36.83,35.56 38.1,36.83 | 38.1,36.83 38.1,40.64 36.83,41.91 IC5.13 | IC4.13 85.09,41.91 87.63,39.37 v87.63,36.83 87.63,29.21 86.36,27.94 82.55,27.94 80.01,25.4 v50.8,25.4 | v95.25,35.56 100.33,35.56 | 100.33,35.56 101.6,36.83 101.6,40.64 100.33,41.91 IC3.13 | IC2.13 148.59,41.91 151.13,39.37 v151.13,36.83 151.13,34.29 149.86,33.02 144.78,33.02 143.51,31.75 IC7.10 139.7,30.48 137.16,29.21 137.16,24.13 136.53,23.5 v135.51,23.5 | v158.75,35.56 163.83,35.56 165.1,36.83 165.1,40.64 163.83,41.91 IC1.13 | 38.1,36.83 39.37,35.56 v39.37,26.67 | v102.87,26.67 102.87,33.02 100.33,35.56
  Bottom 0.254: IC6.13 21.59,41.91 24.13,39.37 24.13,36.83 25.4,35.56 v31.75,35.56 | v87.63,36.83 88.9,35.56 v95.25,35.56 | v151.13,36.83 152.4,35.56 v158.75,35.56 | v39.37,26.67 40.64,25.4 v50.8,25.4 | v102.87,26.67 104.14,25.4 107.95,25.4 110.62,23.5 121.92,23.5 123.83,23.5 v135.51,23.5
N$62  (via drill 0.35)
  Top 0.254: IC1.3 166.37,25.4 161.29,25.4 v160.02,24.13
  Bottom 0.254: IC7.9 142.24,29.21 143.51,27.94 151.13,27.94 153.67,25.4 158.75,25.4 v160.02,24.13
N$63
  Bottom 0.254: IC4.14 86.36,41.91 86.36,52.07 85.09,53.34 81.28,53.34 77.19,57.44 NX4.2
N$64
  Bottom 0.254: IC4.7 92.71,39.37 93.98,40.64 93.98,50.8 90.17,54.61 81.28,54.61 78.87,57.02 NX4.1
N$65
  Bottom 0.254: IC4.6 93.98,36.83 95.25,38.1 95.25,54.52 NX4.0
N$66
  Top 0.254: S1.1 117.27,44.45 118.11,44.45 | 118.11,44.45 R9.1 | J4.1 116.84,35.56 | 116.84,35.56 118.11,36.83 118.11,44.45 | IC7.4 132.08,33.02 119.38,33.02 116.84,35.56
N$67
  Bottom 0.254: IC6.14 19.05,39.37 12.7,45.72 12.7,60.55 NX6.2
N$68
  Bottom 0.254: J2.5 102.87,5.2 102.87,7.62 104.14,8.89 128.27,8.89 R14.2 138.43,19.05 C11.2 138.43,31.75 IC7.11
N$70
  Top 0.254: IC7.7 132.08,25.4 C10.1 R13.1
N$72
  Top 0.254: IC13.1 21.19,65.17 22.86,63.5 41.31,63.5 IC12.6
N$73
  Top 0.254: IC12.1 46.59,65.17 48.26,63.5 79.41,63.5 IC11.6
N$74
  Top 0.254: IC9.1 148.19,65.17 149.86,63.5 168.31,63.5 IC8.6
N$75
  Top 0.254: IC10.1 110.09,65.17 111.76,63.5 142.91,63.5 IC9.6
N$76
  Top 0.254: IC13.2 21.59,66.04 23.5,67.94 40.01,67.94 41.91,66.04 IC12.5
N$77
  Top 0.254: IC12.2 46.99,66.04 48.9,67.94 78.11,67.94 80.01,66.04 IC11.5
N$78
  Top 0.254: IC12.3 46.59,66.91 48.26,68.58 79.41,68.58 IC11.4
N$79
  Top 0.254: IC13.3 21.19,66.91 22.86,68.58 41.31,68.58 IC12.4
N$80
  Top 0.254: IC10.2 110.49,66.04 112.39,67.94 141.6,67.94 143.51,66.04 IC9.5
N$81
  Top 0.254: IC9.2 148.59,66.04 150.5,67.94 167,67.94 168.91,66.04 IC8.5
N$82
  Top 0.254: IC9.3 148.19,66.91 149.86,68.58 168.31,68.58 IC8.4
N$83
  Top 0.254: IC10.3 110.09,66.91 111.76,68.58 142.91,68.58 IC9.4
N$84
  Top 0.254: R10.1 R12.2
  Bottom 0.254: J2.3 92.71,5.12 92.71,8.89 93.98,10.16 115.57,10.16 119.38,13.97 R10.1
N$85
  Top 0.254: R11.1 R13.2
  Bottom 0.254: J2.1 82.55,5.28 82.55,8.89 85.09,11.43 113.67,11.43 117.47,15.24 117.47,19.05 R11.1
N$86
  Top 0.254: C9.1 IC7.6 134.62,27.94 134.62,25.4 133.35,24.13 132.08,24.13 130.81,22.86 130.81,17.78 R12.1
N$88
  Top 0.254: R18.1 R15.1
  Bottom 0.254: J3.1 40.12,8.38 45.72,13.97 54.61,13.97 55.88,15.24 55.88,36.83 R15.1
N$89
  Top 0.254: R16.1 R19.1
  Bottom 0.254: J3.2 45.12,8.29 48.26,11.43 57.15,11.43 58.42,12.7 58.42,34.29 R16.1
N$90
  Top 0.254: R20.1 R17.1
  Bottom 0.254: J3.3 50.12,8.21 50.8,8.89 59.69,8.89 60.96,10.16 R17.1
N$94
  Top 0.254: R15.2 53.34,49.53 49.53,53.34 | 25.4,53.34 21.34,57.15 21.34,58.42 17.57,62.44 IC13.6 | 49.53,53.34 25.4,53.34 | 49.53,53.34 25.4,53.34 | 49.53,53.34 25.4,53.34
N$95
  Top 0.254: R16.2 52.07,38.1 52.07,48.26 48.26,52.07 21.59,52.07 17.27,56.39 17.27,59.18 15.62,60.83 15.62,65.41 16.26,66.04 IC13.5
N$96
  Top 0.254: R17.2 50.8,34.29 50.8,46.99 46.99,50.8 17.78,50.8 10.16,58.42 10.16,67.31 11.18,68.33 14.73,68.33 16.14,66.91 IC13.4
N$97
  Top 0.254: R18.2 83.82,50.8 101.6,50.8 106.3,55.5 106.3,64.99 IC10.6
N$98
  Top 0.254: R19.2 72.39,39.37 72.39,43.18 81.28,52.07 95.25,52.07 100.33,57.15 100.33,62.23 101.98,63.88 102.87,63.88 105.03,66.04 IC10.5
N$99
  Top 0.254: R20.2 71.12,35.56 71.12,44.45 80.01,53.34 93.98,53.34 97.79,57.15 97.79,66.04 100.08,68.33 103.63,68.33 105.05,66.91 IC10.4

### Text on the board
tPlace: HIGH / VOLTAGE! | HIGH / VOLTAGE! | IN-12A / Nixie / Tubes | RGB LED | RGB LED | RGB LED | RGB LED | RGB LED | RGB LED | ANODE | ANODE | ANODE | ANODE | ANODE | ANODE | You're an / inanimate / fuckin' object! | HOUR_1 | HOUR_0 | MIN_1 | MIN_0 | SEC_1 | SEC_0 | AN | AN | PIC | Red, Blue, Green / switches for / LEDs ON/OFF / / POT is for / LED dimming | Push Encoder / to set time / HH:MM:SS / / LED Switch / controls the / Nixie ON/OFF | PICkit3 | 12-Hour Nixie Clock / IN-12A Tubes / N. Brent Burns / March 2018 v1 | Can be programmed as 24-hour clock / (already has the connections) | Switches | POT / (+12V) | Blue | Green | Red | Ch. B | Ch. C | Ch. A | NC | SW1 | SW2 | GND | +5V | +12V | +170V | That's for / John Lennon, / you Yankee / fuckin' cunt! | NO TOUCHY!!! | RGB LED / Connections | Encoder / Connections | DNC about / SW/Ch. polarity | Power / Connections | NO TOUCHY!!!